# EAGLE design Spark_Photon_Weather_Shield (EAGLE 7.2.0)
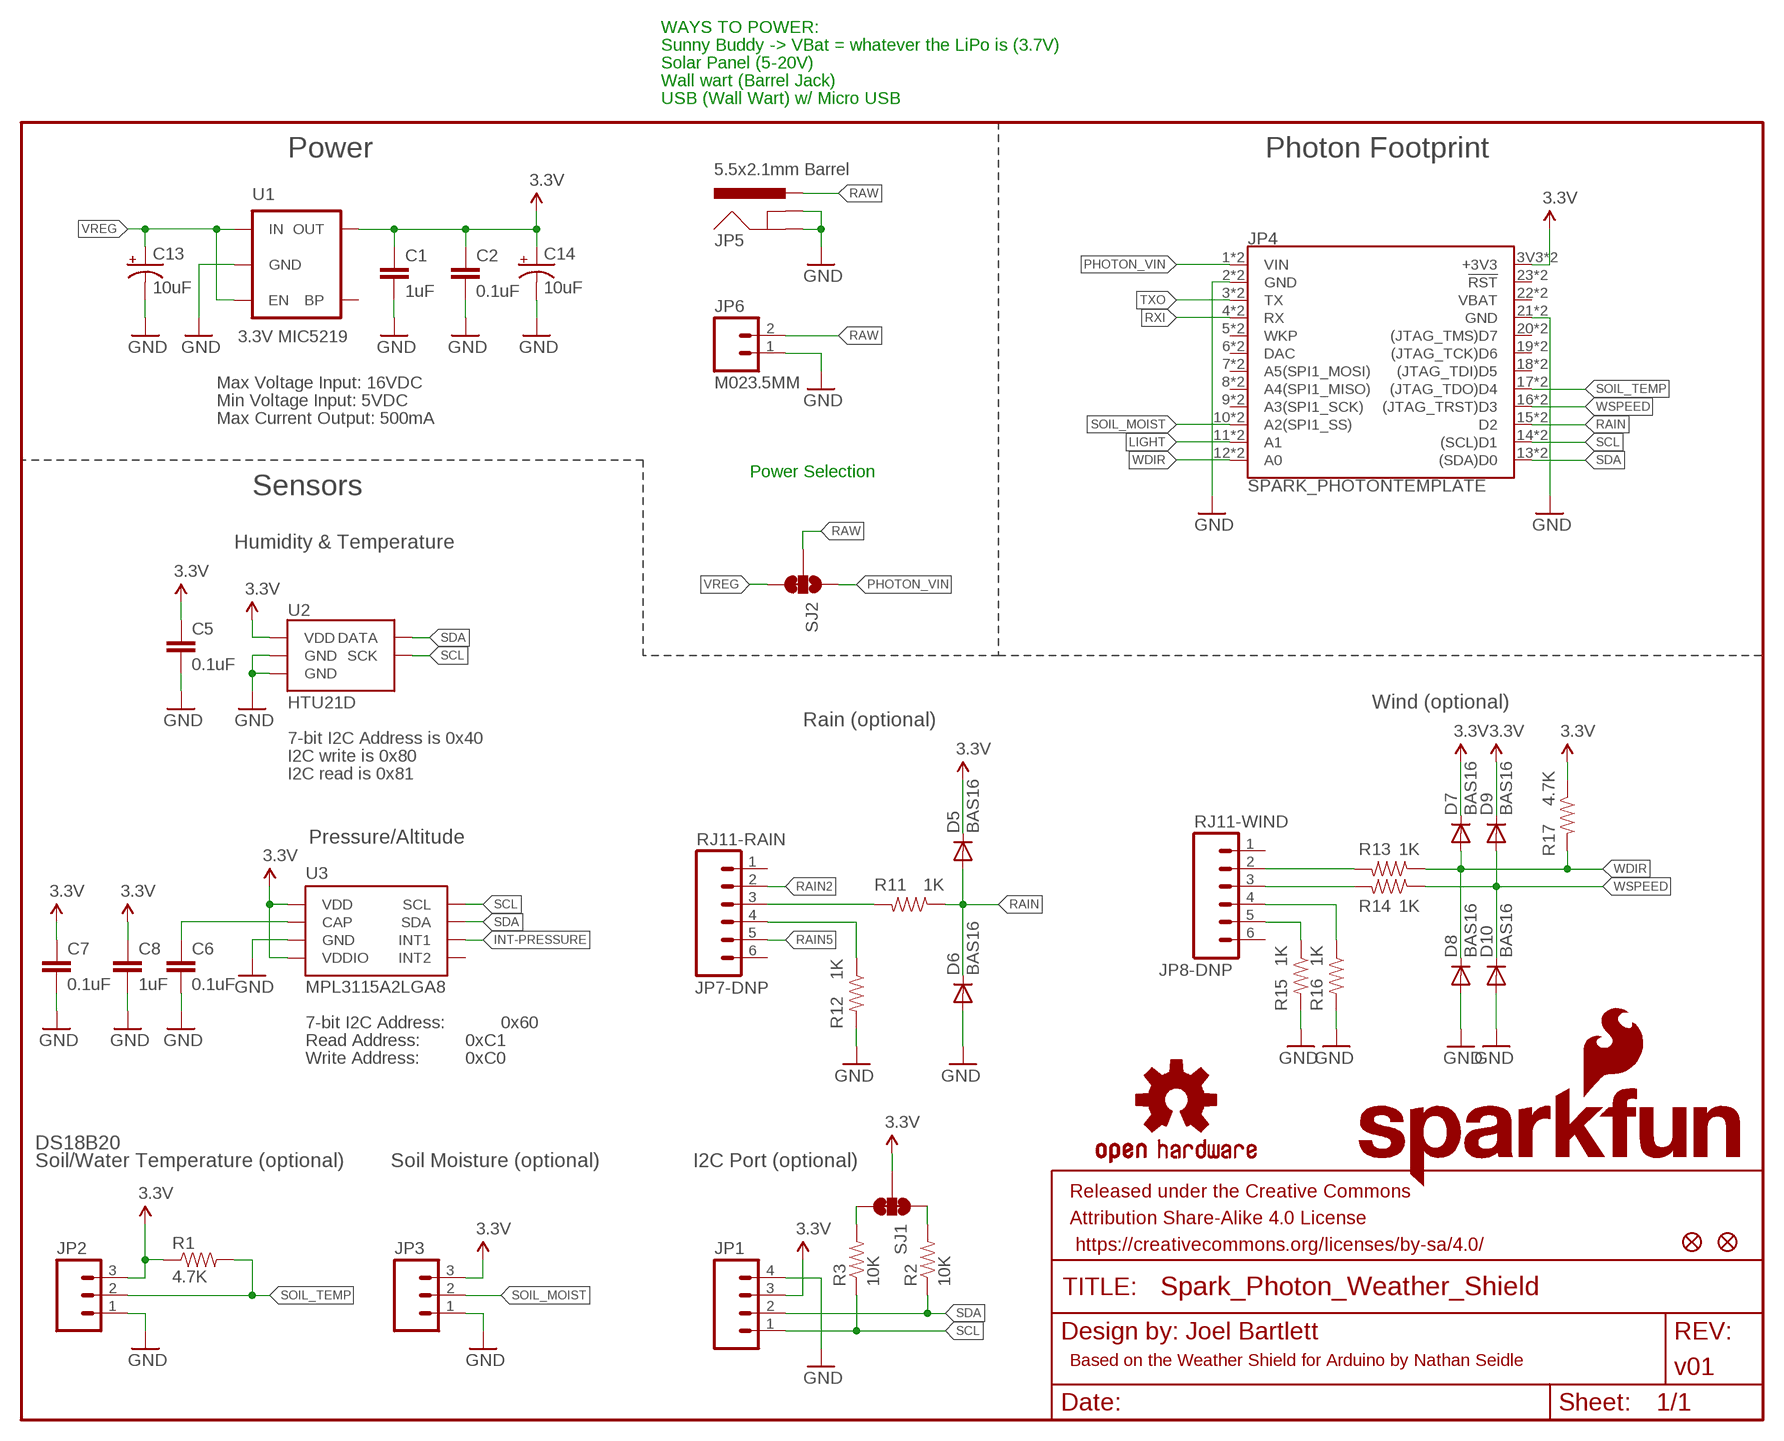
[diagram p0: schematic, sheet 1]

## Parts
C1  1uF  CAP0603-CAP  [0603-CAP]
C2  0.1uF  CAP0603-CAP  [0603-CAP]
C5  0.1uF  CAP0603-CAP  [0603-CAP]
C6  0.1uF  CAP0603-CAP  [0603-CAP]
C7  0.1uF  CAP0603-CAP  [0603-CAP]
C8  1uF  CAP0603-CAP  [0603-CAP]
C13  10uF  CAP_POL1206  [EIA3216]
C14  10uF  CAP_POL1206  [EIA3216]
D5  BAS16  DIODESOD  [SOD-323]
D6  BAS16  DIODESOD  [SOD-323]
D7  BAS16  DIODESOD  [SOD-323]
D8  BAS16  DIODESOD  [SOD-323]
D9  BAS16  DIODESOD  [SOD-323]
D10  BAS16  DIODESOD  [SOD-323]
FID1  FIDUCIAL1X2  [FIDUCIAL-1X2]
FID2  FIDUCIAL1X2  [FIDUCIAL-1X2]
FRAME2  FRAME-LETTER  [CREATIVE_COMMONS]
JP1  M04PTH  [1X04]
JP2  M03PTH  [1X03]
JP3  M03PTH  [1X03]
JP4  SPARK_PHOTONTEMPLATE  [SPARK_PHOTON_TEMPLATE]
JP5  5.5x2.1mm Barrel  POWER_JACKSMD  [POWER_JACK_SMD]
JP6  M023.5MM  [SCREWTERMINAL-3.5MM-2]
JP7-DNP  RJ11-RAIN  RJ11-6PTH  [RJ11-6]
JP8-DNP  RJ11-WIND  RJ11-6PTH  [RJ11-6]
LOGO1  OSHW-LOGOM  [OSHW-LOGO-M]
LOGO2  SFE_LOGO_NAME_FLAME.1_INCH  [SFE_LOGO_NAME_FLAME_.1]
R1  4.7K  4.7KOHM-1/10W-1%(0603)  [0603-RES]
R2  10K  10KOHM-1/10W-1%(0603)0603  [0603-RES]
R3  10K  10KOHM-1/10W-1%(0603)0603  [0603-RES]
R11  1K  RESISTOR0603-RES  [0603-RES]
R12  1K  RESISTOR0603-RES  [0603-RES]
R13  1K  RESISTOR0603-RES  [0603-RES]
R14  1K  RESISTOR0603-RES  [0603-RES]
R15  1K  RESISTOR0603-RES  [0603-RES]
R16  1K  RESISTOR0603-RES  [0603-RES]
R17  4.7K  RESISTOR0603-RES  [0603-RES]
SJ1  JUMPER-PAD-3-NC_BY_TRACE  [PAD-JUMPER-3-3OF3_NC_BY_TRACE_YES_SILK_FULL_BOX]
SJ2  JUMPER-PAD-3-2OF3_NC_BY_TRACE_SMALL  [PAD-JUMPER-3-2OF3_NC_BY_TRACE_YES_SILK_FULL_BOX]
U1  3.3V MIC5219  V_REG_LDOSMD  [SOT23-5]
U2  HTU21D  HTU21DSMD  [HTU21D]
U3  MPL3115A2LGA8  [LGA8]

## Nets
3.3V: C1.1 C2.1 C5.1 C7.1 C8.1 C14.A(+) D5.1(C) D7.1(C) D9.1(C) JP1.3 JP2.3 JP3.3 JP4.3V3(+3V3) JP4.24(+3V3) R1.1 R17.1 SJ1.2 U1.5(OUT) U2.VDD U3.1(VDD) U3.4(VDDIO)
GND: C1.2 C2.2 C5.2 C6.2 C7.2 C8.2 C13.C(-) C14.C(-) D6.2(A) D8.2(A) D10.2(A) JP1.4 JP2.1 JP3.1 JP4.2(GND) JP4.21(GND) JP4.GND@0(GND) JP4.GND@2(GND) JP5.GND(GNDBREAK) JP5.P$4(GND) JP6.1 R12.2 R15.2 R16.2 U1.2(GND) U2.7(GND) U2.GND U3.3(GND)
INT-PRESSURE: U3.6(INT1)
LIGHT: JP4.11(A1) JP4.A1
N$1: JP8-DNP.3 R14.2
N$2: JP8-DNP.2 R13.2
N$3: R3.2 SJ1.3
N$4: JP7-DNP.3 R11.2
N$5: C6.1 U3.2(CAP)
N$6: R2.2 SJ1.1
N$11: JP7-DNP.4 R12.1
N$12: JP8-DNP.5 R15.1
N$13: JP8-DNP.4 R16.1
PHOTON_VIN: JP4.1(VIN) JP4.VIN SJ2.1
RAIN: D5.2(A) D6.1(C) JP4.15(D2) JP4.D2 R11.1
RAIN2: JP7-DNP.2
RAIN5: JP7-DNP.5
RAW [vcc]: JP5.VIN0(PWR) JP6.2 SJ2.2
RXI: JP4.4(RX) JP4.RX
SCL: JP1.1 JP4.14((SCL)D1) JP4.D1((SCL)D1) R3.1 U2.SCK U3.8(SCL)
SDA: JP1.2 JP4.13((SDA)D0) JP4.D0((SDA)D0) R2.1 U2.DATA U3.7(SDA)
SOIL_MOIST: JP3.2 JP4.10(A2(SPI1_SS)) JP4.A2(A2(SPI1_SS))
SOIL_TEMP: JP2.2 JP4.17((JTAG_TDO)D4) JP4.D4((JTAG_TDO)D4) R1.2
TXO: JP4.3(TX) JP4.TX
VREG: C13.A(+) SJ2.3 U1.1(IN) U1.3(EN)
WDIR: D7.2(A) D8.1(C) JP4.12(A0) JP4.A0 R13.1 R17.2
WSPEED: D9.2(A) D10.1(C) JP4.16((JTAG_TRST)D3) JP4.D3((JTAG_TRST)D3) R14.1
Unconnected: JP4.5(WKP) JP4.6(DAC) JP4.7(A5(SPI1_MOSI)) JP4.8(A4(SPI1_MISO)) JP4.9(A3(SPI1_SCK)) JP4.18((JTAG_TDI)D5) JP4.19((JTAG_TCK)D6) JP4.20((JTAG_TMS)D7) JP4.22(VBAT) JP4.23(!RST!) JP4.A3(A3(SPI1_SCK)) JP4.A4(A4(SPI1_MISO)) JP4.A5(A5(SPI1_MOSI)) JP4.D5((JTAG_TDI)D5) JP4.D6((JTAG_TCK)D6) JP4.D7((JTAG_TMS)D7) JP4.DAC JP4.RST(!RST!) JP4.VBAT JP4.WKP JP7-DNP.1 JP7-DNP.6 JP8-DNP.1 JP8-DNP.6 U1.4(BP) U3.5(INT2)

## Notes on the sheet
- WAYS TO POWER:
- Sunny Buddy -> VBat = whatever the LiPo is (3.7V)
- Solar Panel (5-20V)
- Wall wart (Barrel Jack)
- USB (Wall Wart) w/ Micro USB
- Power | Photon Footprint
- Max Voltage Input: 16VDC
- Min Voltage Input: 5VDC
- Max Current Output: 500mA
- Power Selection
- Sensors
- Humidity & Temperature
- Wind (optional)
- Rain (optional)
- 7-bit I2C Address is 0x40
- I2C write is 0x80
- I2C read is 0x81
- Pressure/Altitude
- 7-bit I2C Address: | 0x60
- Read Address: | 0xC1
- Write Address: | 0xC0
- DS18B20
- Soil/Water Temperature (optional) | Soil Moisture (optional) | I2C Port (optional)
- Based on the Weather Shield for Arduino by Nathan Seidle

## Library data of the parts
C1 C2 C5-C8 = SparkFun:CAP: Capacitor Standard 0603 ceramic capacitor, and 0.1" leaded capacitor.
C13 C14 = SparkFun-Passives:CAP_POL: Capacitor Polarized These are standard SMD and PTH capacitors. Normally 10uF, 47uF, and 100uF in electrolytic and tantalum varieties. Always verify the external diameter of the through hole cap, it varies with capacity, voltage, and manufacturer. The EIA devices should be standard.
D5-D10 = SparkFun:DIODE: Diode These are standard reverse protection diodes and small signal diodes. SMA package can handle up to about 1A. SOD-323 can handle about 200mA. What the SOD-323 package when ordering, there are some mfgs out there that are 5-pin packages.
FID1 FID2 = SparkFun-Aesthetics:FIDUCIAL: Fiducial Alignment Points Various fiducial points for machine vision alignment.
FRAME2 = SparkFun-Aesthetics:FRAME-LETTER: Schematic Frame Standard 8.5x11 US Letter frame; DESIGNER: Joel Bartlett; VERSION: v01
JP1 = SparkFun-Connectors:M04: Header 4 Standard 4-pin 0.1" header. Use with straight break away headers (SKU : PRT-00116), right angle break away headers (PRT-00553), swiss pins (PRT-00743), machine pins (PRT-00117), and female headers (PRT-00115). Molex polarized connector foot print use with SKU : PRT-08231 with associated crimp pins and housings. 1MM SMD Version SKU: PRT-10208
JP2 JP3 = SparkFun-Connectors:M03: Header 3 Standard 3-pin 0.1" header. Use with straight break away headers (SKU : PRT-00116), right angle break away headers (PRT-00553), swiss pins (PRT-00743), machine pins (PRT-00117), and female headers (PRT-00115). Molex polarized connector foot print use with SKU : PRT-08232 with associated crimp pins and housings.
JP4 = template_temp:SPARK_PHOTON
JP5 = SparkFun-Connectors:POWER_JACK: Power Jack This is the standard 5.5mm barrel jack for power. The PTH is the most common, proven, reliable, footprint. The Slot footprint only works if the mill layer is transmitted to the PCB fab house so be warned. Mating wall wart : TOL-00298 (and others); PROD_ID: CONN-08106
JP6 = SparkFun-Connectors:M02: Standard 2-pin 0.1" header. Use with - straight break away headers ( PRT-00116) - right angle break away headers (PRT-00553) - swiss pins (PRT-00743) - machine pins (PRT-00117) - female headers (PRT-00115) Molex polarized connector foot print use with: PRT-08233 with associated crimp pins and housings. 2.54_SCREWTERM for use with PRT-10571. 3.5mm Screw Terminal footprints for PRT-08084 5mm Screw Terminal footprints for use with PRT-08432; PROD_ID: CONN-08399
JP7-DNP JP8-DNP = SparkFun:RJ11-6: RJ11 Jack Simple 6 pin RJ11 jack. Commonly found on CAT3 devices and Microchip programmers. SKU: PRT-00132
LOGO1 = SparkFun-Aesthetics:OSHW-LOGO: Open Source Hardware Logo This logo indicates the piece of hardware it is found on incorporates a OSHW license and/or adheres to the definition of open source hardware found here: http://freedomdefined.org/OSHW
LOGO2 = SparkFun-Aesthetics:SFE_LOGO_NAME_FLAME: SFE Logo, name and flame This is the SparkFun full logo. The logo on the schematic will always be the same size; the package variant is the height of the flame part of the logo. Default layer for the logo on the board is tSilk.
R1 = SparkFun-Resistors:4.7KOHM-1/10W-1%(0603): RES-07857; PROD_ID: RES-07857
R2 R3 = SparkFun-Resistors:10KOHM-1/10W-1%(0603): RES-00824; PROD_ID: RES-00824
R11-R17 = SparkFun:RESISTOR: Resistor Basic schematic elements and footprints for 0603, 1206, and PTH resistors.
SJ1 = SparkFun-Passives:JUMPER-PAD-3-NC_BY_TRACE
SJ2 = SparkFun-Passives:JUMPER-PAD-3-2OF3_NC_BY_TRACE
U1 = SparkFun:V_REG_LDO: Voltage Regulator LDO Standard 150mA LDO voltage regulator in SOT-23 layout. Micrel part MIC5205. BP (by-pass) pin is used to lower output noise with 470pF cap.
U2 = SparkFun-Sensors:HTU21D
U3 = SparkFun-Sensors:MPL3115A2: Altimeter/Pressure Sensor, I2C, 1.95V-3.6V supply, 50 to 110kPa

## Net classes
0 Default: width 0.203 mm
1 vcc: width 0.203 mm

## Board
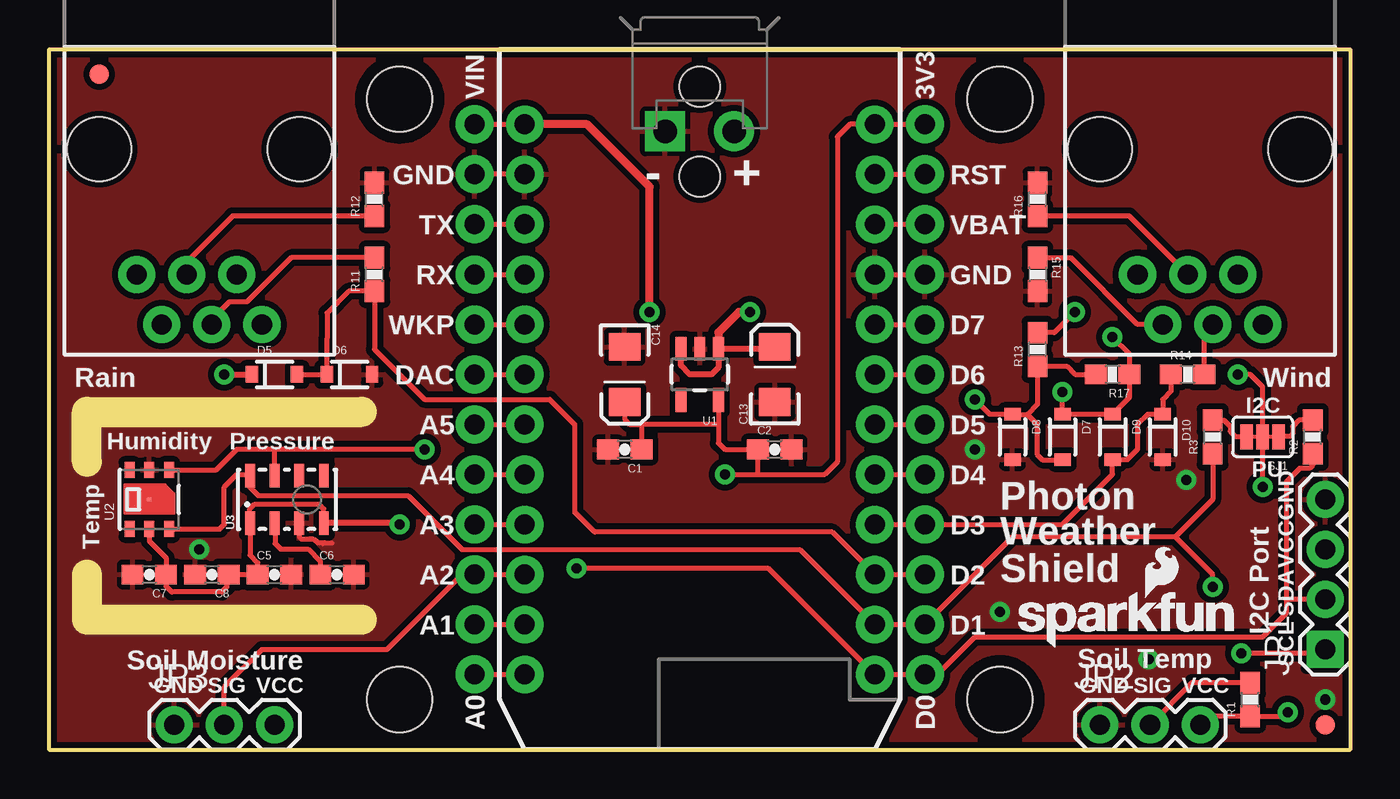
[diagram p1: board, top side]
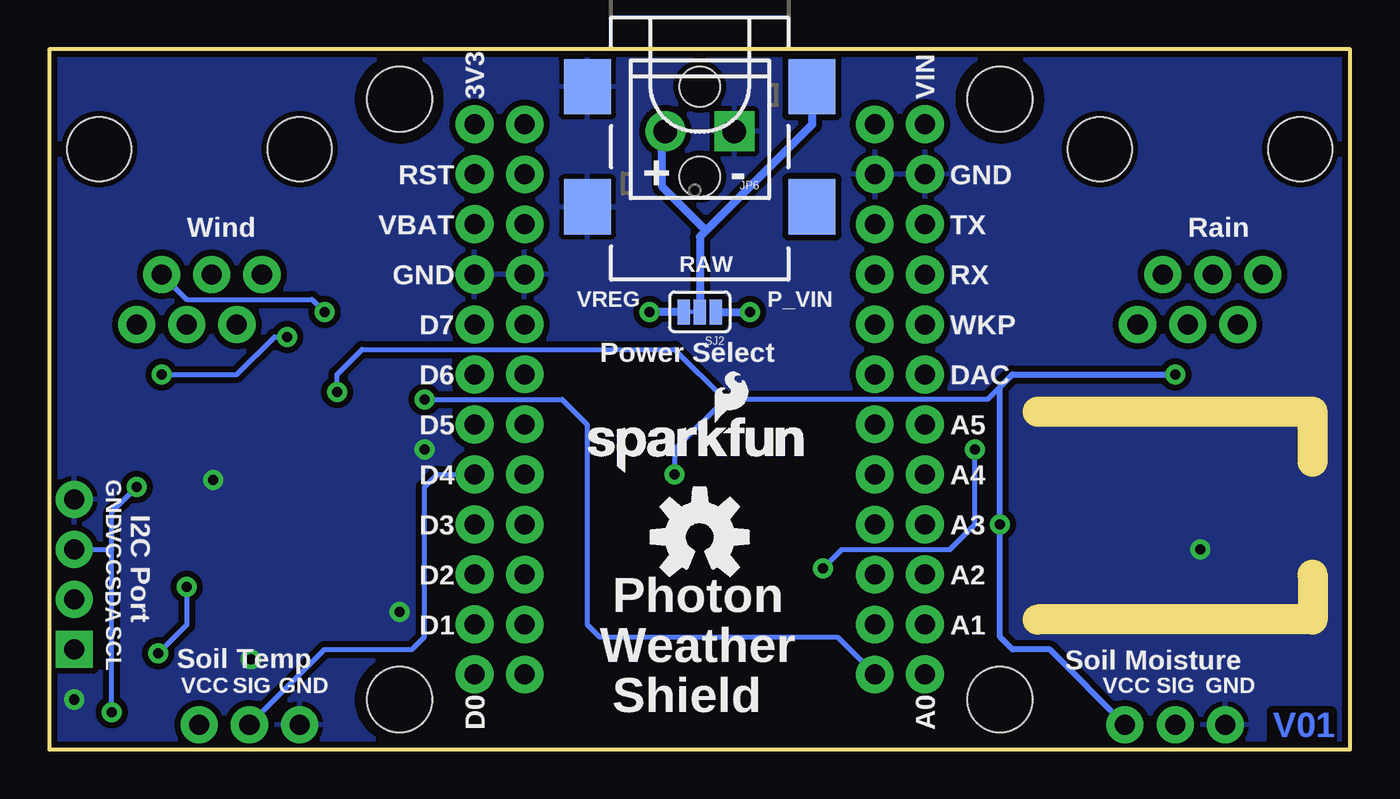
[diagram p2: board, bottom side, seen from below]

Size 66.04 x 35.56 mm. Coordinates in mm from the lower left corner, seen from the top.
Outline: 0,0 0,35.56 66.04,35.56 66.04,0 0,0
Copper layers (1*16): Top 0.035mm / dielectric 1.5mm / Bottom 0.035mm
Design rules "SparkFun-2-layer": minimum track width 7mil, minimum drill 15mil, track to track 8mil, track to pad 8mil, pad to pad 8mil, via to via 8mil, smd to smd 8mil, copper to edge 8mil, drill to drill 8mil, minimum pad ring 12mil, minimum via ring 10mil, stop-mask expansion 4mil, vias tented up to drill 20mil, thermal gap 10mil
tKeepout: area 2.5,6.3 to 16.5,16.5
bKeepout: area 2.5,6.3 to 16.5,16.5
Milling: 4 lines

### Footprints (pad centres in the part's own frame; a part is rotated, then mirrored left to right if it is on the bottom)
0603-CAP = smd 1.1 x 1: 1 -0.85,0; 2 0.85,0
EIA3216 = smd 1.4 x 1.6: A 1.4,0; C -1.4,0
SOD-323 = smd 0.63 x 0.83: 1 -1.15,0; 2 1.15,0
FIDUCIAL-1X2 = smd 1 x 1: 1 0,0
1X04 = drill 1.016 pad 1.88 square: 1 0,0 | drill 1.016 pad 1.88: 2 2.54,0; 3 5.08,0; 4 7.62,0
1X03 = drill 1.016 pad 1.88: 1 0,0; 2 2.54,0; 3 5.08,0
SPARK_PHOTON_TEMPLATE = drill 1.016 pad 1.905: 1 1.27,31.75; 2 1.27,29.21; 3 1.27,26.67; 4 1.27,24.13; 5 1.27,21.59; 6 1.27,19.05; 7 1.27,16.51; 8 1.27,13.97; 9 1.27,11.43; 10 1.27,8.89; 11 1.27,6.35; 12 1.27,3.81; 13 19.05,3.81; 14 19.05,6.35; 15 19.05,8.89; 16 19.05,11.43; 17 19.05,13.97; 18 19.05,16.51; 19 19.05,19.05; 20 19.05,21.59; 21 19.05,24.13; 22 19.05,26.67; 23 19.05,29.21; 24 19.05,31.75 | drill 1.016 pad 1.93: 3V3 21.59,31.75; A0 -1.27,3.81; A1 -1.27,6.35; A2 -1.27,8.89; A3 -1.27,11.43; A4 -1.27,13.97; A5 -1.27,16.51; D0 21.59,3.81; D1 21.59,6.35; D2 21.59,8.89; D3 21.59,11.43; D4 21.59,13.97; D5 21.59,16.51; D6 21.59,19.05; D7 21.59,21.59; DAC -1.27,19.05; GND@0 -1.27,29.21; GND@2 21.59,24.13; RST 21.59,29.21; RX -1.27,24.13; TX -1.27,26.67; VBAT 21.59,26.67; VIN -1.27,31.75; WKP -1.27,21.59 | hole 3.302: -5.08,33.02; 25.4,33.02; -5.08,2.54; 25.4,2.54
POWER_JACK_SMD = smd 2.8 x 2.4: GND 0,-5.7; P$4 6.1,-5.7; VIN0 0,5.7; VIN1 6.1,5.7 | hole 2.032: 0,0; 4.572,0
SCREWTERMINAL-3.5MM-2 = drill 1.2 pad 2.032 square: 1 0,0 | drill 1.2 pad 2.032: 2 3.5,0
RJ11-6 = drill 1.016 pad 1.88: 1 1.905,8.89; 2 3.175,6.35; 3 4.445,8.89; 4 5.715,6.35; 5 6.985,8.89; 6 8.255,6.35 | hole 3.251: 0,0; 10.16,0
0603-RES = smd 1.1 x 1: 1 -0.85,0; 2 0.85,0
PAD-JUMPER-3-3OF3_NC_BY_TRACE_YES_SILK_FULL_BOX = smd 0.635 x 1.27: 1 -0.813,0; 2 0,0; 3 0.813,0
PAD-JUMPER-3-2OF3_NC_BY_TRACE_YES_SILK_FULL_BOX = smd 0.635 x 1.27: 1 -0.813,0; 2 0,0; 3 0.813,0
SOT23-5 = smd 0.55 x 1.2: 1 -0.95,-1.3; 2 0,-1.3; 3 0.95,-1.3; 4 0.95,1.3; 5 -0.95,1.3
HTU21D = smd 0.2 x 0.2: 7 0,0 | smd 0.8 x 0.5: DATA 1.5,-1; GND 1.5,0; NC@1 -1.5,1; NC@6 1.5,1; SCK -1.5,-1; VDD -1.5,0
LGA8 = smd 1.2 x 0.5: 1 -1.2,1.875; 2 -1.2,0.625; 3 -1.2,-0.625; 4 -1.2,-1.875; 5 1.2,-1.875; 6 1.2,-0.625; 7 1.2,0.625; 8 1.2,1.875

### Placement (x,y rotation side)
C1  29.21,15.24 180 top
C2  36.83,15.24 0 top
C5  11.43,8.89 0 top
C6  14.61,8.89 0 top
C7  5.08,8.89 180 top
C8  8.26,8.89 180 top
C13  36.83,19.05 90 top
C14  29.21,19.05 270 top
D5  11.43,19.05 0 top
D6  15.24,19.05 0 top
D7  51.44,15.88 270 top
D8  48.9,15.88 270 top
D9  53.98,15.88 270 top
D10  56.52,15.88 270 top
FID1  64.77,1.27 0 top
FID2  2.54,34.29 0 top
FRAME2  10.16,-10.16 0 top  (outside the outline)
JP1  64.77,5.08 90 top
JP2  53.34,1.27 0 top
JP3  6.35,1.27 0 top
JP4  22.86,0 0 top
JP5  33.02,33.66 270 bottom
JP6  31.27,31.39 180 bottom
JP7-DNP  12.7,30.48 180 top
JP8-DNP  63.5,30.48 180 top
LOGO1  33.02,10.79 0 bottom
LOGO2  48.77,5.08 0 top
R1  60.96,2.54 90 top
R2  64.14,15.88 90 top
R3  59.05,15.88 90 top
R11  16.51,24.13 90 top
R12  16.51,27.94 90 top
R13  50.16,20.32 90 top
R14  57.78,19.05 0 top
R15  50.16,24.13 270 top
R16  50.16,27.94 90 top
R17  53.98,19.05 180 top
SJ1  61.59,15.88 180 top
SJ2  33.02,22.23 180 bottom
U1  33.02,19.05 180 top
U2  5.08,12.7 90 top
U3  12.06,12.7 90 top
U$1  [SFE_LOGO_NAME_FLAME_.1]  39.12,13.97 0 bottom

### Tracks (layer width: path | path; a pad name or v marks a point on that pad's centre or on a via)
3.3V  (via drill 0.51)
  Top 0.254: U2.VDD 5.08,10.59 5.93,9.74 C7.1 | C7.1 5.93,9.18 | C7.1 5.93,8.29 6.22,8 8.76,8 9.02,8.26 9.02,8.8 C8.1 C5.1 10.58,9.49 10.19,9.88 U3.1 10.16,11.53 10.16,12.19 10.41,12.45 13.72,12.45 13.94,12.22 U3.4 | JP2.3 58.84,1.69 R1.1 62.65,1.69 v62.87,1.91 | JP4.24 40.64,31.75 40.01,31.11 40.01,14.61 39.37,13.97 35.94,13.97 | 35.94,15.24 C2.1 36.02,15.2 | v34.29,13.97 35.94,13.97 | v51.44,18.16 D7.1 D9.1 54.83,17.88 R17.1 54.83,20.11 v53.98,20.95 | v61.59,13.34 SJ1.2 61.59,18.41 60.96,19.05 v60.33,19.05 | 35.94,15.24 35.94,13.97 | 33.97,16.51 30.06,16.51 | 30.06,16.51 C1.1 | C14.A 29.21,16.76 29.46,16.51 30.06,16.51 | U1.5 33.97,16.51 | 33.97,16.51 33.97,15.56 34.29,15.24 35.94,15.24
  Top 0.305: v17.78,11.43 17.71,11.5 U3.4 | v8.89,19.05 D5.1
  Bottom 0.254: 17.78,18.41 18.41,17.78 31.75,17.78 | 31.75,17.78 34.29,15.24 v34.29,13.97 | v51.44,18.16 51.44,19.05 50.16,20.32 34.29,20.32 31.75,17.78 | v62.87,1.91 62.87,10.16 | 62.87,10.16 62.87,12.06 v61.59,13.34 | JP1.3 62.87,10.16 | v60.33,19.05 56.52,19.05 54.61,20.95 v53.98,20.95
  Bottom 0.305: JP3.3 15.24,5.08 17.14,5.08 17.78,5.71 v17.78,11.43 17.78,18.41 17.14,19.05 v8.89,19.05
GND  (via drill 0.51)
  Top 0.254: U3.3 12.69,10.8 12.8,10.69 13.41,10.69 13.49,10.62 13.51,10.62 13.61,10.52 13.84,10.52 13.89,10.46 13.89,10.49 13.92,10.52 13.99,10.52 14.02,10.49 14.35,10.49
  other vias: 7.62,10.16 46.99,15.24 64.77,2.54 57.71,13.69 55.8,4.57 48.26,6.99
  pour Bottom (isolate 0.305): 0,0 0,35.56 66.04,35.56 66.04,0
  pour Top (isolate 0.305): 0,0 0,35.56 66.04,35.56 66.04,0
N$1
  Top 0.254: R14.2 58.63,21.17 JP8-DNP.3
N$2  (via drill 0.51)
  Top 0.254: v52.07,22.23 51.02,21.17 R13.2
  Bottom 0.254: JP8-DNP.2 59.05,22.86 52.7,22.86 v52.07,22.23
N$3
  Top 0.254: R3.2 59.63,16.73 59.94,16.41 59.94,16.15 60.2,15.9 60.76,15.9 SJ1.3
N$4
  Top 0.254: R11.2 12.28,24.98 10.03,22.73 9.14,22.73 8.26,21.84 JP7-DNP.3
N$5
  Top 0.254: 13.76,9.36 C6.1 13.76,9.56 13.13,10.19 11.73,10.19 11.46,10.46 11.46,11.46 U3.2
N$6
  Top 0.254: R2.2 63.44,16.73 63.12,16.41 63.12,16.03 62.99,15.9 62.43,15.9 SJ1.1
N$11
  Top 0.254: JP7-DNP.4 6.99,24.77 9.31,27.09 R12.1
N$12
  Top 0.254: JP8-DNP.5 55.24,21.59 51.85,24.98 R15.1
N$13
  Top 0.254: JP8-DNP.4 54.83,27.09 R16.1
PHOTON_VIN  (via drill 0.51)
  Top 0.406: v30.48,22.23 30.48,28.57 27.3,31.75 JP4.1
  Bottom 0.406: SJ2.1 v30.48,22.23
RAIN
  Top 0.254: D5.2 D6.1 14.09,20.86 14.1,20.87 14.1,22.17 15.2,23.28 R11.1 16.51,20.32 19.05,17.78 25.4,17.78 26.67,16.51 26.67,12.06 27.69,11.05 39.75,11.05 JP4.15
RAW
  Bottom 0.406: JP6.2 34.92,31.24 34.92,28.57 32.7,26.35 | JP5.VIN0 27.32,31.77 27.3,31.75 32.7,26.35 | 32.7,26.35 33.02,26.04 SJ2.2
SCL  (via drill 0.51)
  Top 0.254: U2.SCK 8.66,11.2 8.89,11.43 8.89,13.34 9.53,13.97 10.12,13.97 U3.8 10.19,13.3 10.59,12.9 18.21,12.9 20.95,10.16 38.1,10.16 JP4.14 | v59.05,8.26 59.05,8.89 57.15,10.79 | JP1.1 64.57,4.88 v60.5,4.88 | 57.15,10.79 48.9,10.79 JP4.D1 | R3.1 59.05,12.7 57.15,10.79
  Bottom 0.254: v59.05,8.26 59.05,6.33 v60.5,4.88
SDA  (via drill 0.51)
  Top 0.254: U2.DATA 8.48,14.2 9.53,15.24 11.43,15.24 | U3.7 11.43,15.24 | v19.05,15.24 11.43,15.24 | JP4.D0 45.09,3.81 46.99,5.71 61.59,5.71 62.79,6.91 62.79,7.62 | JP1.2 62.79,7.62 | R2.1 64.14,14.43 63.98,14.28 63.48,14.28 62.79,13.59 62.79,7.62 | v26.77,9.2 36.5,9.2 41.88,3.81 JP4.13 41.27,3.81
  Bottom 0.254: v19.05,15.24 19.05,11.43 20.32,10.16 25.81,10.16 v26.77,9.2
SOIL_MOIST
  Top 0.254: JP4.A2 20.95,8.89 17.14,5.08 10.79,5.08 8.89,3.17 JP3.2
SOIL_TEMP
  Top 0.254: R1.2 58,3.39 JP2.2
  Bottom 0.254: JP2.2 52.07,5.08 47.62,5.08 46.99,5.71 46.99,13.34 46.35,13.97 JP4.D4
VREG  (via drill 0.51)
  Top 0.305: C13.A 36.73,20.35 U1.1 33.96,19.41 33.6,19.05 32.51,19.05 32.07,19.49 U1.3
  Top 0.406: v35.56,22.23 35,22.23 33.96,21.18 U1.1
  Bottom 0.406: SJ2.3 v35.56,22.23
WDIR  (via drill 0.51)
  Top 0.254: v46.99,17.78 47.74,17.02 D8.1 49.65,17.02 | 49.65,17.02 50.14,16.54 50.14,14.99 50.42,14.71 51.42,14.71 D7.2 | R17.2 52.07,19.05 51.65,19.47 R13.1 50.16,17.54 49.65,17.02
  Bottom 0.254: v46.99,17.78 40.01,17.78 38.73,16.51 38.73,6.35 38.1,5.71 26.04,5.71 JP4.12
WSPEED
  Top 0.254: R14.1 56.94,18.2 56.52,17.78 D10.1 55.76,17.02 55.24,16.51 55.24,15.24 54.73,14.72 D9.2 53.98,13.97 51.44,11.43 JP4.D3

### Text on the board
Bottom: V01
tPlace: - | + | Rain | Wind | I2C | Humidity | Pressure | PU | Photon | GND | Temp | Weather | Shield | VCC | SDA | I2C Port | Soil Moisture | Soil Temp | SCL | GND | SIG | VCC | GND | SIG | VCC
bPlace: - | + | Rain | Wind | RAW | P_VIN | VREG | Power Select | GND | I2C Port | VCC | SDA | Photon | SCL | Soil Moisture | Weather | Soil Temp | GND | SIG | VCC | GND | SIG | VCC | Shield
tDocu: Turn on Milling Layer (46) | Joel Bartlett